# EAGLE design ProyectoArduino (EAGLE 7.7.0)
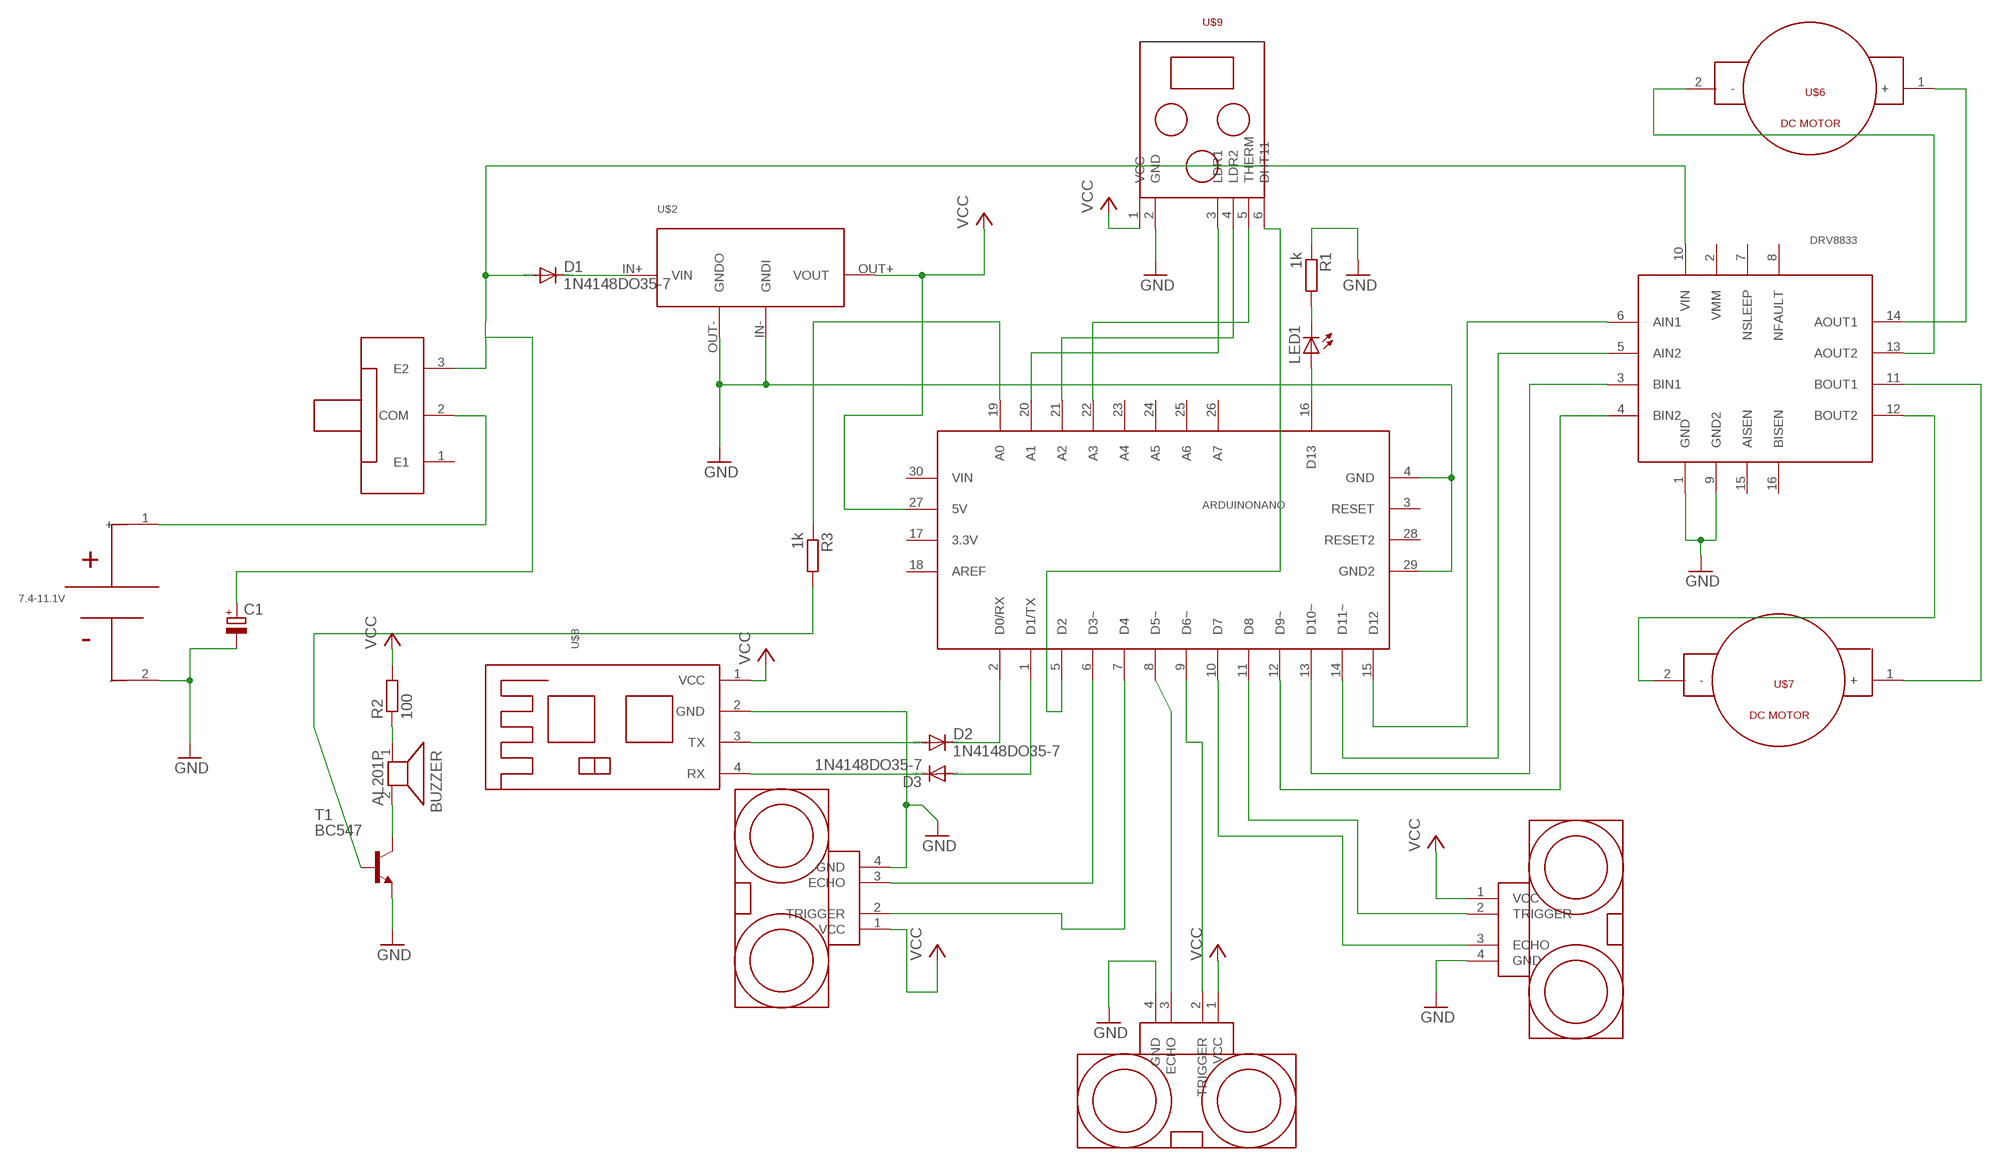
[diagram p0: schematic, sheet 1]

## Parts
7.4-11.1V  INBAT  [INBAT]
ARDUINONANO  NANO  [NANO]
BUZZER  AL201P  [AL201P]
C1  CPOL-EUE3.5-10  [E3,5-10]
D1  1N4148DO35-7  [DO35-7]
D2  1N4148DO35-7  [DO35-7]
D3  1N4148DO35-7  [DO35-7]
DRV8833  MODULO  [MODULO]
LED1  LED3MM  [LED3MM]
R1  1k  R-EU_0204/7  [0204/7]
R2  100  R-EU_0204/7  [0204/7]
R3  1k  R-EU_0204/7  [0204/7]
T1  BC547  [TO92]
U$1  TRIPLEPOLO  [TRIPLEPOLO]
U$2  STEPDOWN  [STEPDOWN]
U$3  HC-SR04  [HC-SR04]
U$4  HC-SR04  [HC-SR04]
U$5  HC-SR04  [HC-SR04]
U$6  OUTPUTMALE  [OUPUTMALE]
U$7  OUTPUTMALE  [OUPUTMALE]
U$8  HC-06  [HC-06]
U$9  PA  [PA]

## Nets
GND: 7.4-11.1V.2(-) ARDUINONANO.4(GND) ARDUINONANO.29(GND2) C1.- DRV8833.1(GND) DRV8833.9(GND2) R1.1 T1.1(E) U$2.IN-(GNDI) U$2.OUT-(GNDO) U$3.4(GND) U$4.4(GND) U$5.4(GND) U$8.2(GND) U$9.2(GND)
N$1: DRV8833.11(BOUT1) U$7.1(+)
N$2: BUZZER.1 R2.1
N$3: D1.C U$2.IN+(VIN)
N$4: DRV8833.12(BOUT2) U$7.2(-)
N$5: DRV8833.14(AOUT1) U$6.1(+)
N$6: DRV8833.13(AOUT2) U$6.2(-)
N$7: BUZZER.2 T1.3(C)
N$9: ARDUINONANO.15(D12) DRV8833.6(AIN1)
N$10: ARDUINONANO.14(D11~) DRV8833.5(AIN2)
N$11: ARDUINONANO.13(D10~) DRV8833.3(BIN1)
N$12: ARDUINONANO.12(D9~) DRV8833.4(BIN2)
N$13: C1.+ D1.A DRV8833.10(VIN) U$1.3(E2)
N$14: ARDUINONANO.19(A0) R3.1
N$15: D2.A U$8.3(TX)
N$16: 7.4-11.1V.1(+) U$1.2(COM)
N$17: ARDUINONANO.11(D8) U$4.2(TRIGGER)
N$18: ARDUINONANO.10(D7) U$4.3(ECHO)
N$19: ARDUINONANO.9(D6~) U$5.2(TRIGGER)
N$20: ARDUINONANO.8(D5~) U$5.3(ECHO)
N$21: ARDUINONANO.6(D3~) U$3.3(ECHO)
N$22: ARDUINONANO.7(D4) U$3.2(TRIGGER)
N$23: D3.C U$8.4(RX)
N$24: R3.2 T1.2(B)
N$25: ARDUINONANO.1(D1/TX) D3.A
N$26: ARDUINONANO.2(D0/RX) D2.C
N$27: ARDUINONANO.20(A1) U$9.3(LDR1)
N$28: ARDUINONANO.21(A2) U$9.4(LDR2)
N$29: ARDUINONANO.22(A3) U$9.5(THERM)
N$30: ARDUINONANO.5(D2) U$9.6(DHT11)
N$39: ARDUINONANO.16(D13) LED1.A
N$40: LED1.K(C) R1.2
VCC: ARDUINONANO.27(5V) R2.2 U$2.OUT+(VOUT) U$3.1(VCC) U$4.1(VCC) U$5.1(VCC) U$8.1(VCC) U$9.1(VCC)
Unconnected: ARDUINONANO.3(RESET) ARDUINONANO.17(3.3V) ARDUINONANO.18(AREF) ARDUINONANO.23(A4) ARDUINONANO.24(A5) ARDUINONANO.25(A6) ARDUINONANO.26(A7) ARDUINONANO.28(RESET2) ARDUINONANO.30(VIN) DRV8833.2(VMM) DRV8833.7(NSLEEP) DRV8833.8(NFAULT) DRV8833.15(AISEN) DRV8833.16(BISEN) U$1.1(E1)

## Library data of the parts
7.4-11.1V = bateriasrobot:INBAT
ARDUINONANO = arduino:NANO
BUZZER = buzzer:AL201P: SPEAKER Source: Buerklin; OC_FARNELL: unknown; OC_NEWARK: unknown
C1 = rcl:CPOL-EU: POLARIZED CAPACITOR, European symbol
D1-D3 = diode:1N4148: DIODE high speed (Philips)
DRV8833 = drv8833:MODULO: This board is very similar to our DRV8835 dual motor driver carrier in operating voltage range and continuous current rating, but the DRV8835 has a lower minimum operating voltage, offers an extra control interface mode, and is 0.1″ smaller in each dimension; we also carry a DRV8835 dual motor driver shield that is easy to use with an Arduino. The DRV8833 has a higher peak current rating (2 A per channel vs 1.5 A), optional built-in current-limiting, and no need for externally supplied logic voltage.
LED1 = led:LED: LED OSRAM: - CHIPLED LG R971, LG N971, LY N971, LG Q971, LY Q971, LO R971, LY R971 LH N974, LH R974 LS Q976, LO Q976, LY Q976 LO Q996 - Hyper CHIPLED LW Q18S LB Q993, LB Q99A, LB R99A - SideLED LS A670, LO A670, LY A670, LG A670, LP A670 LB A673, LV A673, LT A673, LW A673 LH A674 LY A675 LS A676, LA A676, LO A676, LY A676, LW A676 LS A679, LY A679, LG A679 - Hyper Micro SIDELED® LS Y876, LA Y876, LO Y876, LY Y876 LT Y87S - SmartLED LW L88C, LW L88S LB L89C, LB L89S, LG L890 LS L89K, LO L89K, LY L89K LS L896, LA L896, LO L896, LY L896 - TOPLED LS T670, LO T670, LY T670, LG T670, LP T670 LSG T670, LSP T670, LSY T670, LOP T670, LYG T670 LG T671, LOG T671, LSG T671 LB T673, LV T673, LT T673, LW T673 LH T674 LS T676, LA T676, LO T676, LY T676, LB T676, LH T676, LSB T676, LW T676 LB T67C, LV T67C, LT T67C, LS T67K, LO T67K, LY T67K, LW E67C LS E67B, LA E67B, LO E67B, LY E67B, LB E67C, LV E67C, LT E67C LW T67C LS T679, LY T679, LG T679 LS T770, LO T770, LY T770, LG T770, LP T770 LB T773, LV T773, LT T773, LW T773 LH T774 LS E675, LA E675, LY E675, LS T675 LS T776, LA T776, LO T776, LY T776, LB T776 LHGB T686 LT T68C, LB T68C - Hyper Mini TOPLED® LB M676 - Mini TOPLED Santana® LG M470 LS M47K, LO M47K, LY M47K Source: http://www.osram.convergy.de LUXEON: - LUMILED® LXK2-PW12-R00, LXK2-PW12-S00, LXK2-PW14-U00, LXK2-PW14-V00 LXK2-PM12-R00, LXK2-PM12-S00, LXK2-PM14-U00 LXK2-PE12-Q00, LXK2-PE12-R00, LXK2-PE12-S00, LXK2-PE14-T00, LXK2-PE14-U00 LXK2-PB12-K00, LXK2-PB12-L00, LXK2-PB12-M00, LXK2-PB14-N00, LXK2-PB14-P00, LXK2-PB14-Q00 LXK2-PR12-L00, LXK2-PR12-M00, LXK2-PR14-Q00, LXK2-PR14-R00 LXK2-PD12-Q00, LXK2-PD12-R00, LXK2-PD12-S00 LXK2-PH12-R00, LXK2-PH12-S00 LXK2-PL12-P00, LXK2-PL12-Q00, LXK2-PL12-R00 Source: www.luxeon.com KINGBRIGHT: KA-3528ASYC Source: www.kingbright.com
R1-R3 = rcl:R-EU_: RESISTOR, European symbol
T1 = transistor-neu-to92:BC547: NPN TRANSISTOR
U$1 = interruptores:TRIPLEPOLO: TRIPLE POLO DOBLE TIRO, INTERRUPTOR CHIDORI MAMALON PARA APAGAR TU ROBOT Y NO SE LE GASTE LA PILA, O NO ANDE ANDANDO POR AHI EL CABRON
U$2 = fuenteconmutada:STEPDOWN: Fuente conmutada tipo stepdown Vin [4.5 a 28V] Vot [0.8 a 20V] Corriente Maxima: 3A Eficiencia de Conversion maxima = 96% frecuencia de conmutacion 15MHz maxima, 1MHz tipica
U$3-U$5 = hc-sr04:HC-SR04: Sensor de distancia usando modulo ultrasonico 40MHz a 5V
U$6 U$7 = motores:OUTPUTMALE
U$8 = hc-06:HC-06
U$9 = sensorescaseros:PA

## Board
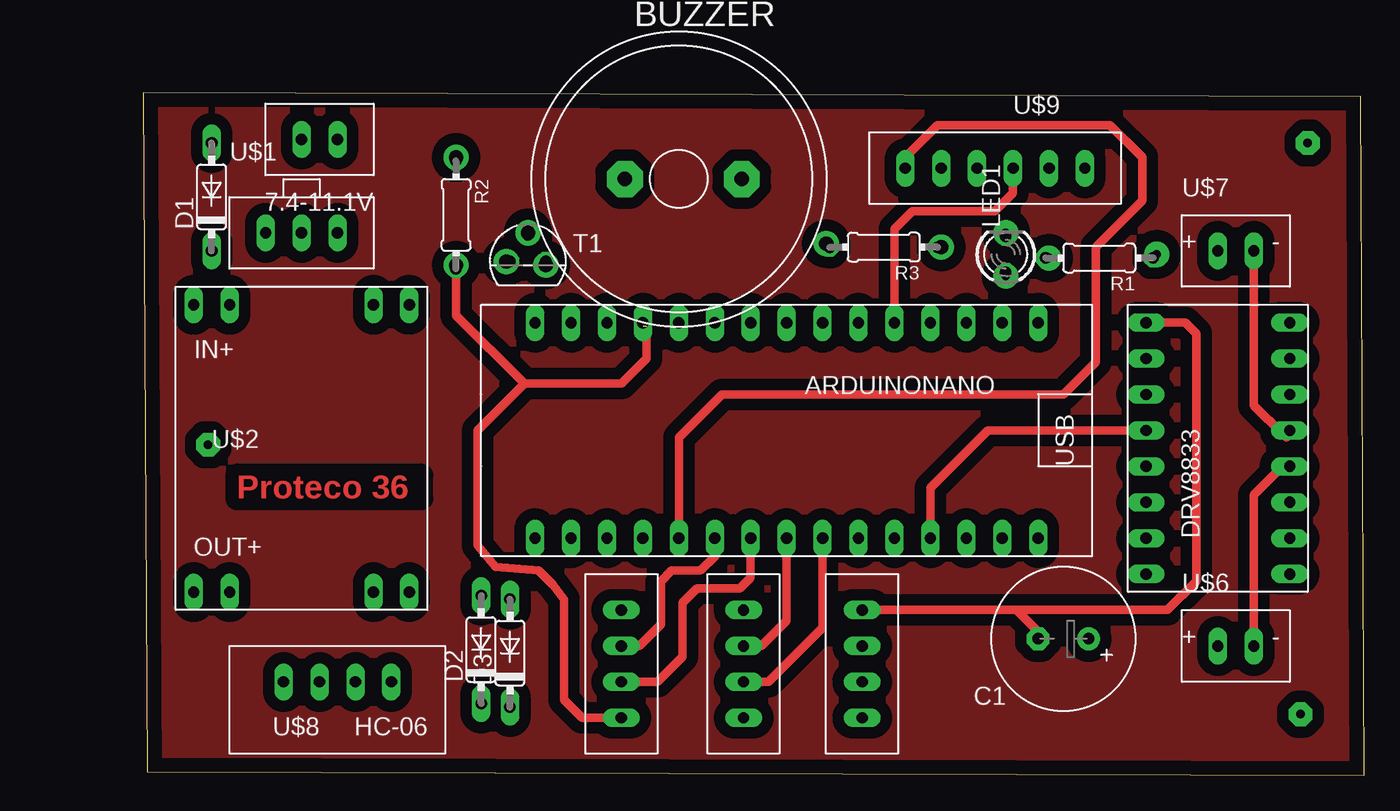
[diagram p1: board, top side]
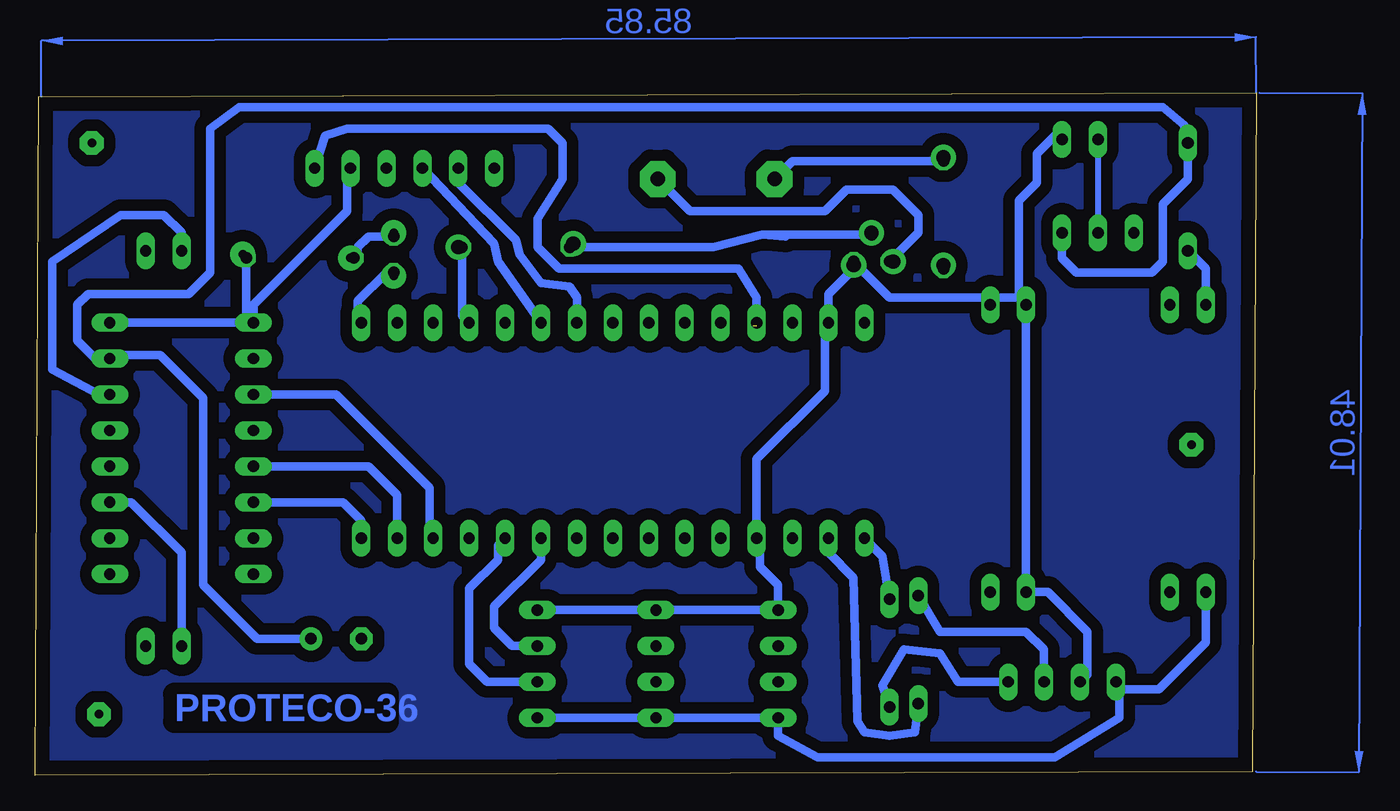
[diagram p2: board, bottom side, seen from below]

Size 86.28 x 48.25 mm. Coordinates in mm from the lower left corner, seen from the top.
Outline: 0.25,0.25 86.28,0 86.03,48 0,48.25 0.25,0.25
Copper layers (1*16): Top 0.035mm / dielectric 1.5mm / Bottom 0.035mm
Design rules "default": minimum track width 10mil, minimum drill 24mil, track to track 8mil, track to pad 8mil, pad to pad 8mil, via to via 8mil, smd to smd 8mil, copper to edge 40mil, drill to drill 8mil, minimum pad ring 10mil, minimum via ring 8mil, stop-mask expansion 4mil, vias tented up to drill 0mil, thermal gap 10mil

### Footprints (pad centres in the part's own frame; a part is rotated, then mirrored left to right if it is on the bottom)
INBAT = drill 0.8 long: 1 0,0; 2 -2.54,0
NANO = drill 0.8 long: 1 -7.62,-8.89; 2 -5.08,-8.89; 3 -2.54,-8.89; 4 0,-8.89; 5 2.54,-8.89; 6 5.08,-8.89; 7 7.62,-8.89; 8 10.16,-8.89; 9 12.7,-8.89; 10 15.24,-8.89; 11 17.78,-8.89; 12 20.32,-8.89; 13 22.86,-8.89; 14 25.4,-8.89; 15 27.94,-8.89; 16 27.94,6.35; 17 25.4,6.35; 18 22.86,6.35; 19 20.32,6.35; 20 17.78,6.35; 21 15.24,6.35; 22 12.7,6.35; 23 10.16,6.35; 24 7.62,6.35; 25 5.08,6.35; 26 2.54,6.35; 27 0,6.35; 28 -2.54,6.35; 29 -5.08,6.35; 30 -7.62,6.35
AL201P = drill 1.016 pad 2.54 octagon: 1 -3.81,0; 2 4.445,0
E3,5-10 = drill 0.813 pad 1.6: + -1.778,0 | drill 0.813 pad 1.6 octagon: - 1.778,0
DO35-7 = drill 0.813 long: A 3.81,0; C -3.81,0
MODULO = drill 0.8 long: 1 -3.81,7.62; 2 -3.81,5.08; 3 -3.81,2.54; 4 -3.81,0; 5 -3.81,-2.54; 6 -3.81,-5.08; 7 -3.81,-7.62; 8 -3.81,-10.16; 9 6.35,7.62; 10 6.35,5.08; 11 6.35,2.54; 12 6.35,0; 13 6.35,-2.54; 14 6.35,-5.08; 15 6.35,-7.62; 16 6.35,-10.16
LED3MM = drill 0.813 octagon: A -1.27,0; K 1.27,0
0204/7 = drill 0.813 octagon: 1 -3.81,0; 2 3.81,0
TO92 = drill 0.813 octagon: 1 1.27,0; 2 0,1.905; 3 -1.27,0
TRIPLEPOLO = drill 0.8 long: 1 -2.54,0; 2 0,0; 3 2.54,0
STEPDOWN = drill 0.8 long: IN2+ -5.08,7.62; IN2- 7.62,7.62; IN+ -7.62,7.62; IN- 5.08,7.62; OUT2+ -5.08,-12.7; OUT2- 7.62,-12.7; OUT+ -7.62,-12.7; OUT- 5.08,-12.7
HC-SR04 = drill 0.8 long: 1 -17.78,8.89; 2 -17.78,6.35; 3 -17.78,3.81; 4 -17.78,1.27
OUPUTMALE = drill 0.8 long: 1 -1.27,0; 2 1.27,0
HC-06 = drill 0.8 long: 1 -1.27,5.08; 2 -3.81,5.08; 3 -6.35,5.08; 4 -8.89,5.08
PA = drill 0.8 long: 1 6.35,0; 2 3.81,0; 3 1.27,0; 4 -1.27,0; 5 -3.81,0; 6 -6.35,0

### Placement (x,y rotation side)
7.4-11.1V  11.18,44.96 180 top
ARDUINONANO  35.31,25.65 0 top
BUZZER  37.85,42.16 0 top
C1  65.02,9.65 180 top
D1  4.83,40.89 90 top
D2  23.88,8.89 90 top
D3  25.91,8.64 90 top
DRV8833  74.68,24.38 0 top
LED1  60.96,36.83 90 top
R1  67.56,36.58 180 top
R2  22.1,39.62 270 top
R3  52.32,37.34 180 top
T1  27.18,36.32 0 top
U$1  11.18,38.35 0 top
U$2  11.18,25.65 0 top
U$3  16,12.95 180 top
U$4  33.02,12.95 180 top
U$5  24.64,12.95 180 top
U$6  77.22,9.14 0 top
U$7  77.22,37.08 0 top
U$8  8.64,11.68 180 top
U$9  60.2,42.93 0 top

### Tracks (layer width: path | path; a pad name or v marks a point on that pad's centre or on a via)
GND
  Top 0.61: U$4.4 61.72,11.68 | 61.72,11.68 72.39,11.68 74.42,13.72 74.42,31.24 73.66,32 DRV8833.1 | C1.- 63.25,10.16 61.72,11.68
  Bottom 0.61: 7.4-11.1V.2 13.72,45.72 15.49,43.94 15.49,41.91 16.76,40.64 16.76,33.78 | 16.76,33.78 U$2.IN- U$2.OUT- 14.73,12.95 11.94,10.16 11.94,7.11 U$8.2 | U$4.4 U$5.4 U$3.4 33.78,13.46 35.05,14.73 35.05,16.51 ARDUINONANO.4 35.31,22.35 30.48,27.18 30.48,31.75 ARDUINONANO.29 30.23,34.04 28.7,35.56 28.7,36.07 T1.1 25.91,33.78 16.76,33.78 | DRV8833.9 DRV8833.1 | DRV8833.1 70.87,33.27 64.26,39.88 64.26,42.67 U$9.2 | R1.1 71.37,32.51 DRV8833.1
N$1
  Bottom 0.61: U$7.1 75.95,38.35 77.22,39.62 80.26,39.62 85.09,36.32 85.09,28.7 81.79,26.92 DRV8833.11
N$2
  Bottom 0.61: R2.1 32.77,43.43 BUZZER.1
N$3
  Bottom 0.61: U$2.IN+ 3.56,35.81 D1.C
N$4
  Top 0.61: U$7.2 78.49,26.16 80.52,24.13 81.03,24.13 | 81.03,24.13 81.53,24.64 | 81.03,24.13 80.77,23.88 80.77,24.13 DRV8833.12
N$5
  Bottom 0.61: U$6.1 75.95,15.75 79.5,19.3 DRV8833.14
N$6
  Top 0.61: U$6.2 78.49,19.81 80.26,21.59 80.77,21.59 DRV8833.13
N$7
  Bottom 0.61: T1.3 23.88,38.35 23.88,39.62 25.65,41.4 28.96,41.4 30.48,39.88 40.01,39.88 BUZZER.2
N$8
  pour Bottom (isolate 0.813): 0,0.25 86.11,-0.25 85.85,47.75 -0.25,48.26
N$9
  Bottom 0.61: ARDUINONANO.15 63.25,18.03 64.52,19.3 DRV8833.6
N$10
  Bottom 0.61: DRV8833.5 62.74,21.84 60.71,19.81 ARDUINONANO.14
N$11
  Bottom 0.61: DRV8833.3 65.02,26.92 58.42,20.32 58.42,17.02 ARDUINONANO.13
N$12
  Top 0.61: DRV8833.4 59.69,24.38 55.63,20.32 ARDUINONANO.12
N$13
  Bottom 0.61: U$1.3 13.72,36.58 12.7,35.56 7.37,35.56 6.6,36.32 6.6,40.39 4.83,42.16 D1.A 5.08,44.96 5.08,45.97 6.6,47.24 71.88,47.24 73.91,45.72 73.91,35.56 75.44,34.04 82.55,34.04 83.31,33.27 83.31,30.73 82.04,29.46 DRV8833.10 80.77,29.72 77.47,29.72 74.42,26.67 74.42,13.46 70.61,9.65 C1.+
N$14
  Bottom 0.61: ARDUINONANO.19 55.63,31.75 55.88,31.5 55.88,32 55.37,32.51 55.37,32.26 ARDUINONANO.19 | R3.1 56.13,32.51 ARDUINONANO.19
N$15
  Bottom 0.61: U$8.3 14.99,8.89 16.26,10.16 22.35,10.16 D2.A
N$16
  Bottom 0.406: 7.4-11.1V.1 U$1.2
N$17
  Bottom 0.61: U$4.2 54.36,6.6 55.63,7.87 55.63,13.21 53.59,15.24 53.59,16.26 ARDUINONANO.11
N$18
  Bottom 0.61: U$4.3 52.58,9.14 53.85,10.41 53.85,11.94 50.55,15.24 ARDUINONANO.10
N$19
  Top 0.61: ARDUINONANO.9 48.01,10.41 44.2,6.6 U$5.2
N$20
  Top 0.61: U$5.3 43.69,9.14 45.47,10.92 ARDUINONANO.8
N$21
  Top 0.61: U$3.3 35.05,9.14 36.58,10.67 36.58,13.72 37.34,14.48 39.37,14.48 40.39,15.49 ARDUINONANO.6
N$22
  Top 0.61: U$3.2 36.32,6.6 38.1,8.38 38.1,12.19 39.12,13.21 42.16,13.21 42.93,13.97 ARDUINONANO.7
N$23
  Bottom 0.61: U$8.4 21.08,6.6 22.35,8.64 24.89,8.89 26.42,6.35 D3.C
N$24
  Bottom 0.61: R3.2 38.35,37.34 34.93,38.23 | 34.93,38.23 33.27,38.1 | T1.2 34.93,38.23
N$25
  Bottom 0.61: D3.A 26.42,15.49 ARDUINONANO.1
N$26
  Bottom 0.61: ARDUINONANO.2 30.23,15.75 28.45,13.97 28.19,3.81 27.69,3.05 25.91,2.79 24.13,3.05 D2.C
N$27
  Top 0.61: ARDUINONANO.20 53.09,38.61 54.36,39.88 60.2,39.88 61.47,41.15 U$9.3
N$28
  Bottom 0.61: ARDUINONANO.21 53.59,36.32 53.85,37.59 U$9.4
N$29
  Bottom 0.61: U$9.5 56.39,41.91 52.32,37.85 52.07,36.83 50.55,34.8 48.51,34.54 48.01,33.78 ARDUINONANO.22
N$30
  Top 0.61: ARDUINONANO.5 37.85,23.88 40.89,26.92 65.02,26.92 67.31,29.21 67.31,37.34 70.61,40.64 70.61,43.69 68.33,45.97 56.13,45.97 54.1,43.94 54.1,43.18 U$9.6
N$31  (via drill 1 pad 1.78)
  other vias: 27.18,38.35
N$32  (via drill 1 pad 1.78)
  other vias: 25.65,36.32
N$33  (via drill 1 pad 1.78)
  other vias: 28.45,36.07
N$34  (via drill 1 pad 1.78)
  other vias: 22.1,36.07
N$35  (via drill 1 pad 1.78)
  other vias: 22.1,43.69
N$36  (via drill 1 pad 1.78)
  other vias: 56.39,37.34
N$37  (via drill 1 pad 1.78)
  other vias: 48.26,37.59
N$38
  pour Top (isolate 0.813): 0,48.26 85.85,48.01 86.11,0 0.25,0.25
N$39
  Bottom 0.61: LED1.A 61.47,35.56 63.5,33.53 63.5,32.26 ARDUINONANO.16
N$40
  Bottom 0.61: LED1.K 62.74,38.1 63.5,37.34 63.5,36.83 R1.2
N$41  (via drill 0.6 pad 1.78)
  other vias: 60.96,35.31
N$42  (via drill 0.6 pad 1.78)
  other vias: 60.96,38.35
N$43  (via drill 0.6 pad 1.78)
  other vias: 64.01,36.58
N$44  (via drill 0.6 pad 1.78)
  other vias: 71.63,36.83
N$45  (via drill 0.6 pad 1.68)
  other vias: 4.57,23.37
N$46  (via drill 0.6 pad 1.68)
  other vias: 81.79,4.32
N$47  (via drill 0.6 pad 1.68)
  other vias: 82.3,44.7
VCC  (1 unrouted)
  Top 0.61: U$3.1 30.99,4.06 29.72,5.33 29.72,12.45 28.96,13.46 27.94,14.48 24.89,14.73 23.62,16.26 23.62,24.38 26.92,27.69 | 26.92,27.69 33.78,27.69 35.56,29.46 35.56,31.5 | 35.56,31.5 35.56,32.51 35.31,32.77 35.31,31.75 35.56,31.5 | R2.2 22.1,32.51 26.92,27.69
  Bottom 0.61: U$2.OUT+ 3.56,9.4 6.86,6.1 9.4,6.1 U$8.1 9.65,6.35 9.65,4.06 14.22,1.27 30.99,1.27 33.78,2.79 U$3.1 U$5.1 U$4.1 | U$9.1 65.79,45.21 64.26,45.72 50.04,45.72 49.02,44.7 49.02,42.16 50.8,39.37 50.8,37.34 49.28,35.81 36.58,35.81 35.31,33.78 ARDUINONANO.27 | ARDUINONANO.27 35.31,31.5 35.56,31.24 35.56,31.75 ARDUINONANO.27
(copper drawn outside any net)
  shapes: Bottom area x2

### Text on the board
Top: Proteco 36
Bottom: PROTECO-36